# Altium schematic sheet programming.SchDoc: OPO
size Letter; Author: Kuo, Huang; Revision: 4.0; SheetNumber: 5; SheetTotal: 7
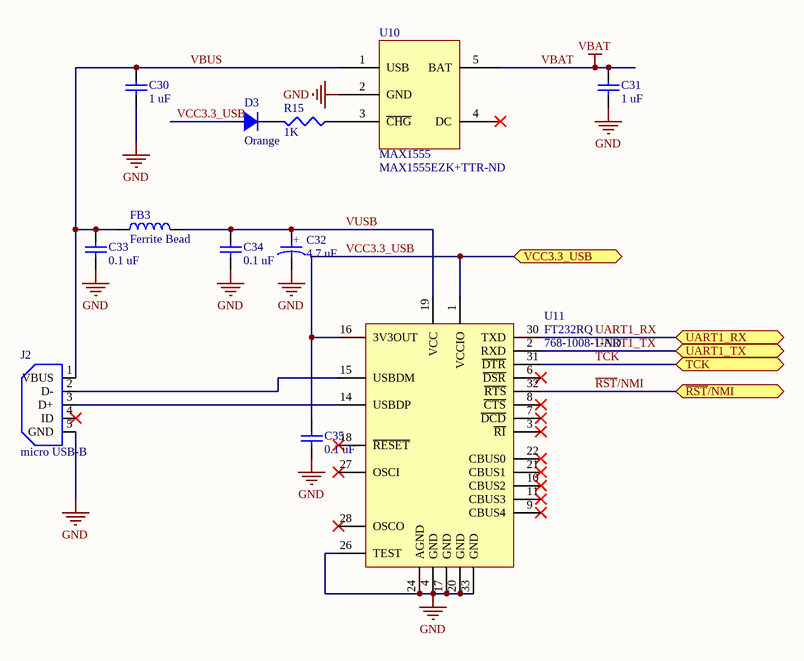
[diagram p0: programming.SchDoc]

## Parts
C30  value 1 uF  [0402]  (hidden comment: Ceramic capacitor)
C31  value 1 uF  [0402]  (hidden comment: Ceramic capacitor)
C32  value 4.7 uF  [0603 - Polar Marking]  (hidden comment: Tantalum capacitor)
C33  value 0.1 uF  [0402]  (hidden comment: Ceramic capacitor)
C34  value 0.1 uF  [0402]  (hidden comment: Ceramic capacitor)
C35  value 0.1 uF  [0402]  (hidden comment: Ceramic capacitor)
D3  Color: Orange  [0402 - DIODE]  (hidden comment: LED, Orange)
FB3  Ferrite Bead  [0402]
J2  micro USB-B  [Micro USB-B]
R15  value 1K  [0402]  (hidden comment: Chip resistor)
U10  MAX1555  Supplier Part Number 1: MAX1555EZK+TTR-ND  [SOT23-5]
U11  FT232RQ  Supplier Part Number 1: 768-1008-1-ND  [QFN-32]

## Ports
TCK, UART1_RX, UART1_TX, VCC3.3_USB, ~{RST}/NMI

## Nets
GND: C30.2 C31.2 C32.2 C33.2 C34.2 C35.2 J2.5(GND) U10.2(GND) U11.4(GND) U11.17(GND) U11.20(GND) U11.24(AGND) U11.26(TEST) U11.33(GND)
VBAT: C31.1 U10.5(BAT)
~{RST}/NMI: U11.32(~{RTS}) ; port ~{RST}/NMI
TCK: U11.31(~{DTR}) ; port TCK
UART1_RX: U11.30(TXD) ; port UART1_RX
UART1_TX: U11.2(RXD) ; port UART1_TX
VBUS: C30.1 C33.1 FB3.2 J2.1(VBUS) U10.1(USB)
VCC3.3_USB: C35.1 D3.1 U11.1(VCCIO) U11.16(3V3OUT) ; port VCC3.3_USB
VUSB: C32.1 C34.1 FB3.1 U11.19(VCC)
NetD3_2: D3.2 R15.1
NetJ2_2: J2.2(D-) U11.15(USBDM)
NetJ2_3: J2.3(D+) U11.14(USBDP)
NetR15_2: R15.2 U10.3(~{CHG})

Not connected (* = marked no-connect by the designer): J2 4(ID)*; U10 4(DC)*; U11 3(~{RI})* 6(~{DSR})* 7(~{DCD})* 8(~{CTS})* 9(CBUS4)* 10(CBUS2)* 11(CBUS3)* 18(~{RESET})* 21(CBUS1)* 22(CBUS0)* 27(OSCI)* 28(OSCO)*

## Notes on the sheet
- Title
- Date:
- Author:
- Revision:
- Sheet
- of
- University of Michigan
- File:
- (in symbol C_4.7u_0603_tantalum) +

## Library data of the parts
C30 C31 = C_1u_0402_ceramic: Ceramic capacitor, 1 uF, 0402 package; Manufacture: TDK; voltage rated: 6.3 V; tolerance: 10%; package: 0402; Supplier 1: Digi-Key; Supplier Part Number 1: 445-5000-1-ND
C32 = C_4.7u_0603_tantalum: Tantalum capacitor, 4.7 uF, 0603 package; Manufacture: Rohm; voltage rated: 10 V; tolerance: 20%; package: 0603; Supplier 1: Digi-Key; Supplier Part Number 1: 511-1496-1-ND
C33-C35 = C_0.1u_0402_ceramic: Ceramic capacitor, 0.1u, 0402 package; Manufacture: TDK; voltage rated: 10 V; tolerance: 10%; Supplier 1: Digi-Key; Supplier Part Number 1: 445-1265-1-ND; package: 0402
D3 = D_LED_ORANGE_0402: LED, Orange, 0402; Supplier 1: Digi-Key; Supplier Part Number 1: 511-1590-1-ND; package: 0402
FB3 = FB_150mA_0402: Ferrite Bead, 150 mA, 0402 package; impedance@Freq: 1K@100 MHz; current rating: 150 mA; Supplier 1: Digi-Key; Supplier Part Number 1: 587-1835-1-ND; package: 0402
J2 = Micro USB: CONN USB MICRO B RECPT SMT R/A; Supplier 1: Digi-Key; Supplier Part Number 1: 609-4616-6-ND
R15 = R_1K_0402: Chip resistor, 1K, 0402 package; tolerance: 1%; power: 1/16 W; Supplier 1: Digi-Key; Supplier Part Number 1: 541-1.00KLCT-ND; package: 0402
U10 = MAX1555: 3 Dual-Input USB/AC Adapter 1-Cell Li+  Battery Chargers; Supplier 1: Digi-Key
U11 = IC_FT232RQ: FT232R USB UART; Manufacturer: *; Note: *; ManufacturerPartNo: *; Supplier 1: Digi-Key